# Altium schematic sheet ST_LINK.SCHDOC
size A4; Revision: B.2(PCB.SCH)
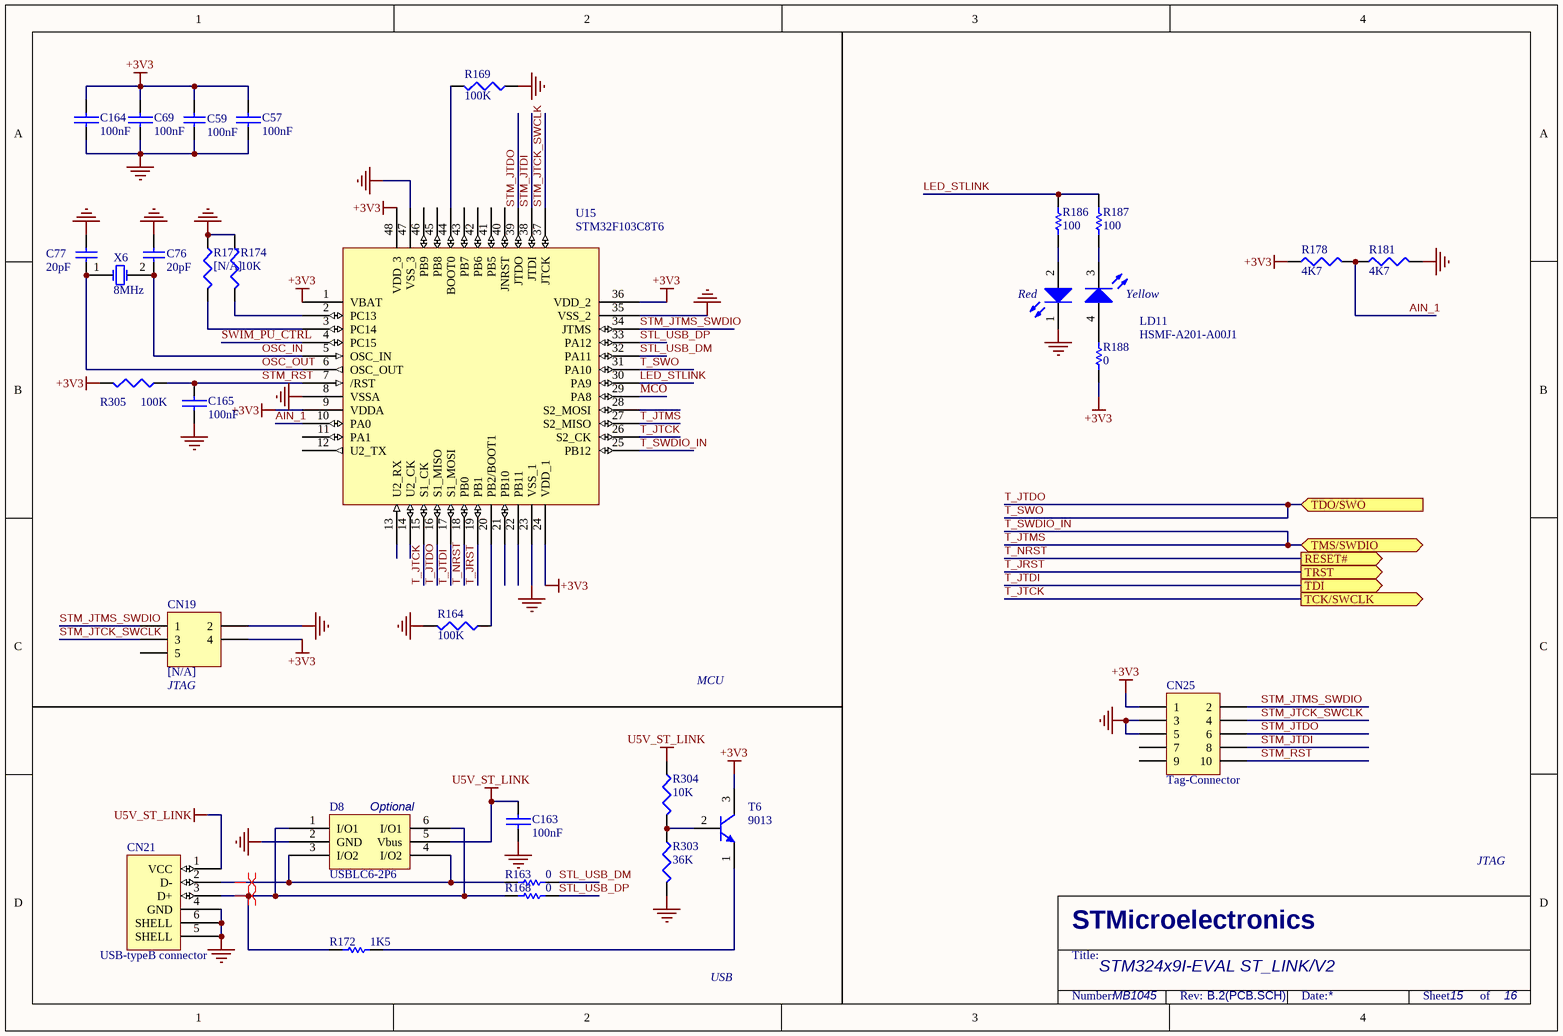
[diagram p0: ST_LINK.SCHDOC]

## Parts
C57  100nF  [0603C]
C59  100nF  [0603C]
C69  100nF  [0603C]
C76  20pF  [0603C]
C77  20pF  [0603C]
C163  100nF  [0603C]
C164  100nF  [0603C]
C165  100nF  [0603C]
CN19  [N/A]  [HDR_2X3-1_2R54-6]
CN21  USB-typeB connector  [USB-B]
CN25  Tag-Connector  [TC2050-IDC-FP]
D8  USBLC6-2P6  [SOT-563]
LD11  HSMF-A201-A00J1  [LED2_3528]
R163  0  [0603R]
R164  100K  [0603R]
R168  0  [0603R]
R169  100K  [0603R]
R172  1K5  [0603R]
R174  10K  [0603R]
R177  [N/A]  [0603R]
R178  4K7  [0603R]
R181  4K7  [0603R]
R186  100  [0603R]
R187  100  [0603R]
R188  0  [0603R]
R303  36K  [0603R]
R304  10K  [0603R]
R305  100K  [0603R]
T6  9013  [SOT23-213]
U15  STM32F103C8T6  [LQFP48_0R5_9X9]
X6  8MHz  [XTAL_2SM_12R7X4R7]

## Ports
RESET# (out), TCK/SWCLK (out), TDI (out), TDO/SWO (in), TMS/SWDIO (bidir), TRST (out)

## Nets
+3V3: C57.2 C59.1 C69.2 C164.2 CN19.4 CN25.1 R178.1 R188.2 R305.2 T6.3(C) U15.1(VBAT) U15.9(VDDA) U15.24(VDD_1) U15.36(VDD_2) U15.48(VDD_3)
GND: C57.1 C59.2 C69.1 C76.1 C77.1 C163.2 C164.1 C165.1 CN19.2 CN21.4(GND) CN21.5(SHELL) CN21.6(SHELL) CN25.3 CN25.5 D8.2(GND) LD11.1(RED_cathode) R164.2 R169.1 R174.1 R177.1 R181.2 R303.2 U15.8(VSSA) U15.23(VSS_1) U15.35(VSS_2) U15.47(VSS_3)
U5V_ST_LINK: C163.1 CN21.1(VCC) D8.5(Vbus) R304.1
AIN_1: R178.2 R181.1 U15.10(PA0)
LED_STLINK: R186.1 R187.1 U15.30(PA9)
MCO: U15.29(PA8)
OSC_IN: C76.2 U15.5(OSC_IN) X6.2(OSC2)
OSC_OUT: C77.2 U15.6(OSC_OUT) X6.1(OSC1)
STL_USB_DM: R163.1 U15.32(PA11)
STL_USB_DP: R168.1 U15.33(PA12)
STM_JTCK_SWCLK: CN19.3 CN25.4 U15.37(JTCK)
STM_JTDI: CN25.8 U15.38(JTDI)
STM_JTDO: CN25.6 U15.39(JTDO)
STM_JTMS_SWDIO: CN19.1 CN25.2 U15.34(JTMS)
STM_RST: C165.2 CN25.10 R305.1 U15.7(/RST)
SWIM_PU_CTRL: U15.4(PC15)
T_JRST: U15.19(PB1) ; port TRST
T_JTCK: U15.15(S1_CK) U15.26(S2_CK) ; port TCK/SWCLK
T_JTDI: U15.17(S1_MOSI) ; port TDI
T_JTDO: U15.16(S1_MISO) U15.31(PA10) ; port TDO/SWO  [also labelled T_SWO]
T_JTMS: U15.25(PB12) U15.27(S2_MISO) ; port TMS/SWDIO  [also labelled T_SWDIO_IN]
T_NRST: U15.18(PB0) ; port RESET#
NetCN21_2: CN21.2(D-) D8.3(I/O2) D8.4(I/O2) R163.2
NetCN21_3: CN21.3(D+) D8.1(I/O1) D8.6(I/O1) R168.2 R172.2
NetLD11_2: LD11.2(Red_anode) R186.2
NetLD11_3: LD11.3(YellowGreen_cathode) R187.2
NetLD11_4: LD11.4(YellowGreen_anode) R188.1
NetR164_1: R164.1 U15.20(PB2/BOOT1)
NetR169_2: R169.2 U15.44(BOOT0)
NetR172_1: R172.1 T6.1(E)
NetR174_2: R174.2 U15.2(PC13)
NetR177_2: R177.2 U15.3(PC14)
NetR303_1: R303.1 R304.2 T6.2(B)

Not connected (* = marked no-connect by the designer): CN19 5; CN25 7 9; U15 11(PA1) 12(U2_TX) 13(U2_RX) 14(U2_CK) 21(PB10) 22(PB11) 28(S2_MOSI) 40(JNRST) 41(PB5) 42(PB6) 43(PB7) 45(PB8) 46(PB9)

## Layout directives
differential pair: NetCN21_2, NetCN21_3

## Notes on the sheet
- (near CN19) JTAG
- MCU
- (near D8) Optional
- JTAG
- USB
- STM324x9I-EVAL ST_LINK/V2
- MB1045
- 15
- 16
- STMicroelectronics
- Title:
- Number:
- Rev:
- Date:
- Sheet          of
- (in symbol HSMF-A201-A00J1) Red; Yellow

## Library data of the parts
C57 C69 C164 C165 = CAP
C59 = Cap: Capacitor; Value: 10nF; Published: 8-Jun-2000; Revision: July-2002: Re-released for DXP Platform.; Publisher: Altium Limited
C76 C77 = Cap: Capacitor; Published: 8-Jun-2000; LatestRevisionDate: 17-Jul-2002; LatestRevisionNote: Re-released for DXP Platform.; PackageReference: RAD-0.3; Publisher: Altium Limited; Value: 20pF
C163 = CAP: Capacitor
CN19 = Header 3X2: Header, 3-Pin, Dual row; Revision: 17-Jul-2002: Re-released for DXP Platform.; Publisher: Altium Limited
CN25 = Tag-Connector: Header, 6-Pin, Dual row; Revision: 17-Jul-2002: Re-released for DXP Platform.; Publisher: Altium Limited
D8 = USBLC6-2
R163 R168 R172 R186-R188 = Res1: Resistor; Value: 1K; Published: 8-Jun-2000; Revision: July-2002: Re-released for DXP Platform.; Publisher: Altium Limited
R164 R169 R178 R181 R305 = RES1
R174 R177 R303 R304 = R: Right: 20; Bottom: 30
T6 = NPN: NPN Bipolar Transistor; Code - JEDEC: TO-226-AA; Published: 8-Jun-2000; Revision: July-2002: Re-released for DXP Platform.; Publisher: Altium Limited
U15 = STM32F10x(48pin)
X6 = XTAL: Crystal Oscillator; Published: 8-Jun-2000; LatestRevisionDate: 17-Jul-2002; LatestRevisionNote: Re-released for DXP Platform.; PackageReference: R38; Publisher: Altium Limited